# EAGLE design SMU (EAGLE 9.2.1)
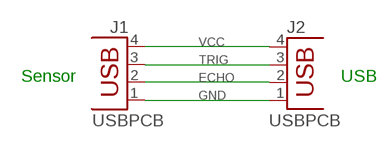
[diagram p0: schematic, sheet 1]

## Parts
J1  USBPCB  [USB-A-PCB-NOPASTE]
J2  USBPCB  [USB-A-PCB-NOPASTE]

## Nets
ECHO: J1.2(D-) J2.2(D-)
GND: J1.1(VBUS) J2.1(VBUS)
TRIG: J1.3(D+) J2.3(D+)
VCC: J1.4(GND) J2.4(GND)

## Notes on the sheet
- Sensor | USB

## Library data of the parts
J1 J2 = ParkingPal:USBPCB

## Board
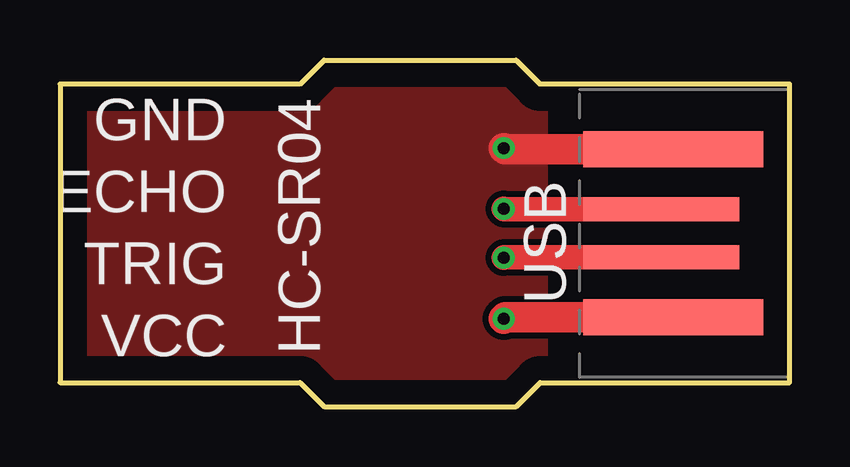
[diagram p1: board, top side]
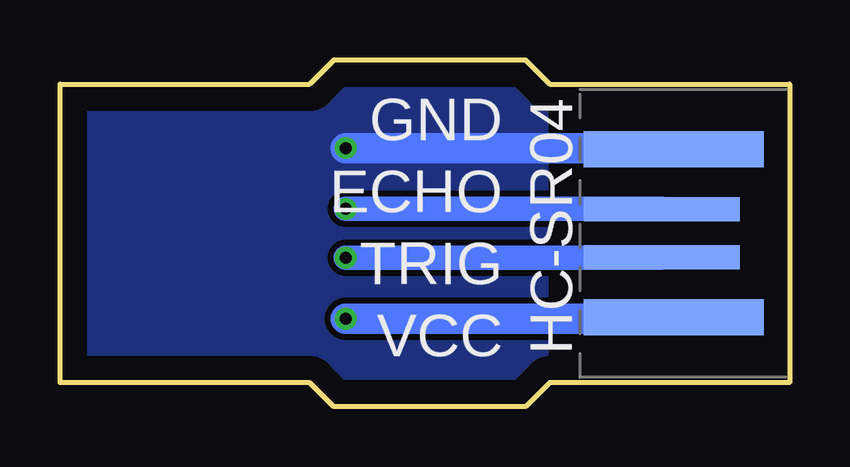
[diagram p2: board, bottom side, seen from below]

Size 30.4 x 14.45 mm. Coordinates in mm from the lower left corner, seen from the top.
Outline: 0,1 10,1 11,0 19,0 20,1 30.4,1 30.4,13.45 20,13.45 19,14.45 11,14.45 10,13.45 0,13.45 0,1
Copper layers (1*16): Top 0.035mm / dielectric 1.5mm / Bottom 0.035mm
Design rules "default *": minimum track width 6mil, minimum drill 0.35mm, track to track 6mil, track to pad 6mil, pad to pad 6mil, via to via 6mil, smd to smd 6mil, copper to edge 40mil, drill to drill 6mil, minimum pad ring 10mil, minimum via ring 8mil, stop-mask expansion 4mil, vias tented up to drill 25mil, thermal gap 10mil

### Footprints (pad centres in the part's own frame; a part is rotated, then mirrored left to right if it is on the bottom)
USB-A-PCB-NOPASTE = smd 7.5 x 1.5: 1 -0.2,-3.5; 4 -0.2,3.5 | smd 6.5 x 1: 2 0.3,-1; 3 0.3,1

### Placement (x,y rotation side)
J1  5.03,7.22 180 bottom
J2  25.35,7.22 180 top

### Tracks (layer width: path | path; a pad name or v marks a point on that pad's centre or on a via)
ECHO  (via drill 0.5)
  Top 1.016: J2.2 18.51,8.22 v18.49,8.24
  Bottom 1.016: v18.49,8.24 5.35,8.24 J1.2
GND  (via drill 0.5)
  Top 1.27: J2.1 18.55,10.72 v18.49,10.78
  Bottom 1.27: v18.49,10.78 4.89,10.78 J1.1
  pour Top (isolate 0.254): -2.59,16.11 20.27,16.11 20.27,-1.67 -2.59,-1.67
  pour Bottom (isolate 0.254): 32.97,16.11 10.11,16.11 10.11,-1.67 32.97,-1.67
TRIG  (via drill 0.5)
  Top 1.016: J2.3 18.51,6.22 v18.49,6.21
  Bottom 1.016: v18.49,6.21 5.35,6.21 J1.3
VCC  (via drill 0.5)
  Top 1.27: J2.4 18.55,3.72 v18.49,3.67
  Bottom 1.27: v18.49,3.67 4.89,3.67 J1.4

### Text on the board
tPlace: GND | ECHO | USB | TRIG | VCC | HC-SR04
bPlace: GND | ECHO | TRIG | VCC | HC-SR04